# Altium schematic sheet Interface - RS485.SchDoc: [11] Interface - RS485
size A4; ApprovedBy: Nagy Richard; CheckedBy: Nagy Richard; Author: Nagy Richard; CompanyName: EmbedCore; DrawnBy: Nagy Richard; Engineer: Nagy Richard; Organization: EmbedCore; DocumentNumber: 11; Revision: 1.0; SheetNumber: 11; SheetTotal: 11
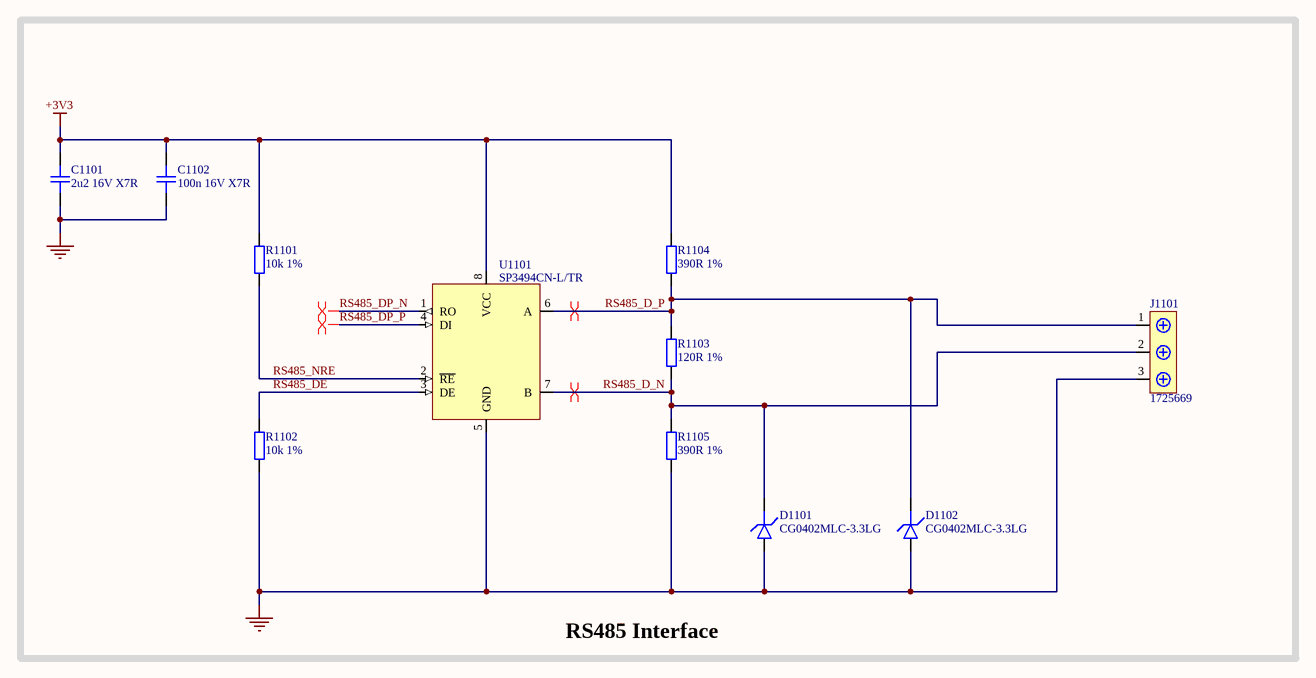
[diagram p0: Interface - RS485.SchDoc]

## Parts
C1101  2u2 16V X7R  [CAP_0603]
C1102  100n 16V X7R  [CAP_0402]
D1101  CG0402MLC-3.3LG  [D_0402]
D1102  CG0402MLC-3.3LG  [D_0402]
J1101  1725669  [1725669]
R1101  10k 1%  [RES_0402]
R1102  10k 1%  [RES_0402]
R1103  120R 1%  [RES_0402]
R1104  390R 1%  [RES_0402]
R1105  390R 1%  [RES_0402]
U1101  SP3494CN-L/TR  [SOIC-8]

## Blocks framed on the sheet
RS485 Interface: C1101 C1102 D1101 D1102 J1101 R1101-R1105 U1101

## Nets
+3V3: C1101.2 C1102.2 R1101.2 R1104.2 U1101.8(VCC)
GND: C1101.1 C1102.1 D1101.A D1102.A J1101.3 R1102.1 R1105.1 U1101.5(GND)
RS485_D_N: D1101.K J1101.2 R1103.1 R1105.2 U1101.7(B)
RS485_D_P: D1102.K J1101.1 R1103.2 R1104.1 U1101.6(A)
RS485_DE: R1102.2 U1101.3(DE)
RS485_DP_N: U1101.1(RO)
RS485_DP_P: U1101.4(DI)
RS485_NRE: R1101.1 U1101.2(~{RE})

## Layout directives
differential pair: RS485_D_N, RS485_D_P, RS485_DP_N, RS485_DP_P

## Notes on the sheet
- Title:
- Drawn By:
- Page Contents:
- Checked By:
- Size:
- Date:
- File:
- License:
- Email:
- A4
- Number:
- Time:
- Revision:
- Sheet
- Website:
- of

## Library data of the parts
C1101 = CAP_0603: Capacitor SMD 0603; Manufacturer: YAGEO; Manufacturer Part Number: CC0603KRX7R7BB225; Distributor Link: www.lcsc.com; LCSC: C914769; Rating: *; Dielectric: *
C1102 = CAP_0402: Capacitor SMD 0402; Manufacturer: YAGEO; Manufacturer Part Number: CC0402JRX7R7BB104; Distributor Link: www.lcsc.com; LCSC: C541464; Rating: *; Dielectric: *
D1101 D1102 = D_TVS_0402: Diode TVS / ESD 0402
J1101 = 1725669: Screw Terminal Block 3 Positions 2.54mm; Manufacturer: Phoenix; Manufacturer Part Number: 1725669; Distributor Link: https://www.mouser.de/ProductDetail/Phoenix-Contact/1725669?qs=A%2FKWGUWTCZjmkTL0Oe91ew%3D%3D
R1101 R1102 = RES_0402: Resistor SMD 0402; Manufacturer: PANASONIC; Manufacturer Part Number: ERJPA2F1002X; Distributor Link: www.lcsc.com; LCSC: C427247
R1103 = RES_0402: Resistor SMD 0402; Manufacturer: PANASONIC; Manufacturer Part Number: ERJ2GEJ121X; Distributor Link: www.lcsc.com; LCSC: C412974
R1104 R1105 = RES_0402: Resistor SMD 0402; Manufacturer: PANASONIC; Manufacturer Part Number: ERJ2GEJ391X; Distributor Link: www.lcsc.com; LCSC: C412983
U1101 = SP3494CN-L/TR: 3.3V Low Power RS-485 / RS-422 Transceiver SOIC-8; Manufacturer: MaxLinear; Manufacturer Part Number: SP3494CN-L/TR